# EasyEDA Pro project ProProject_Tautek_ESP32S3_2024-01-15.epro, schematic Schematic1
Create Date: 2023-11-28; Page Name: P1; Project Name: Tautek_ESP32S3; Schematic Name: Schematic1; Update Date: 2024-01-07; Company: EasyEDA.com; Drawed: EasyEDA Pro; Page Size: A4; Part Number: JLCPCB-002; Reviewed: EasyEDA Pro; Version: V0.1
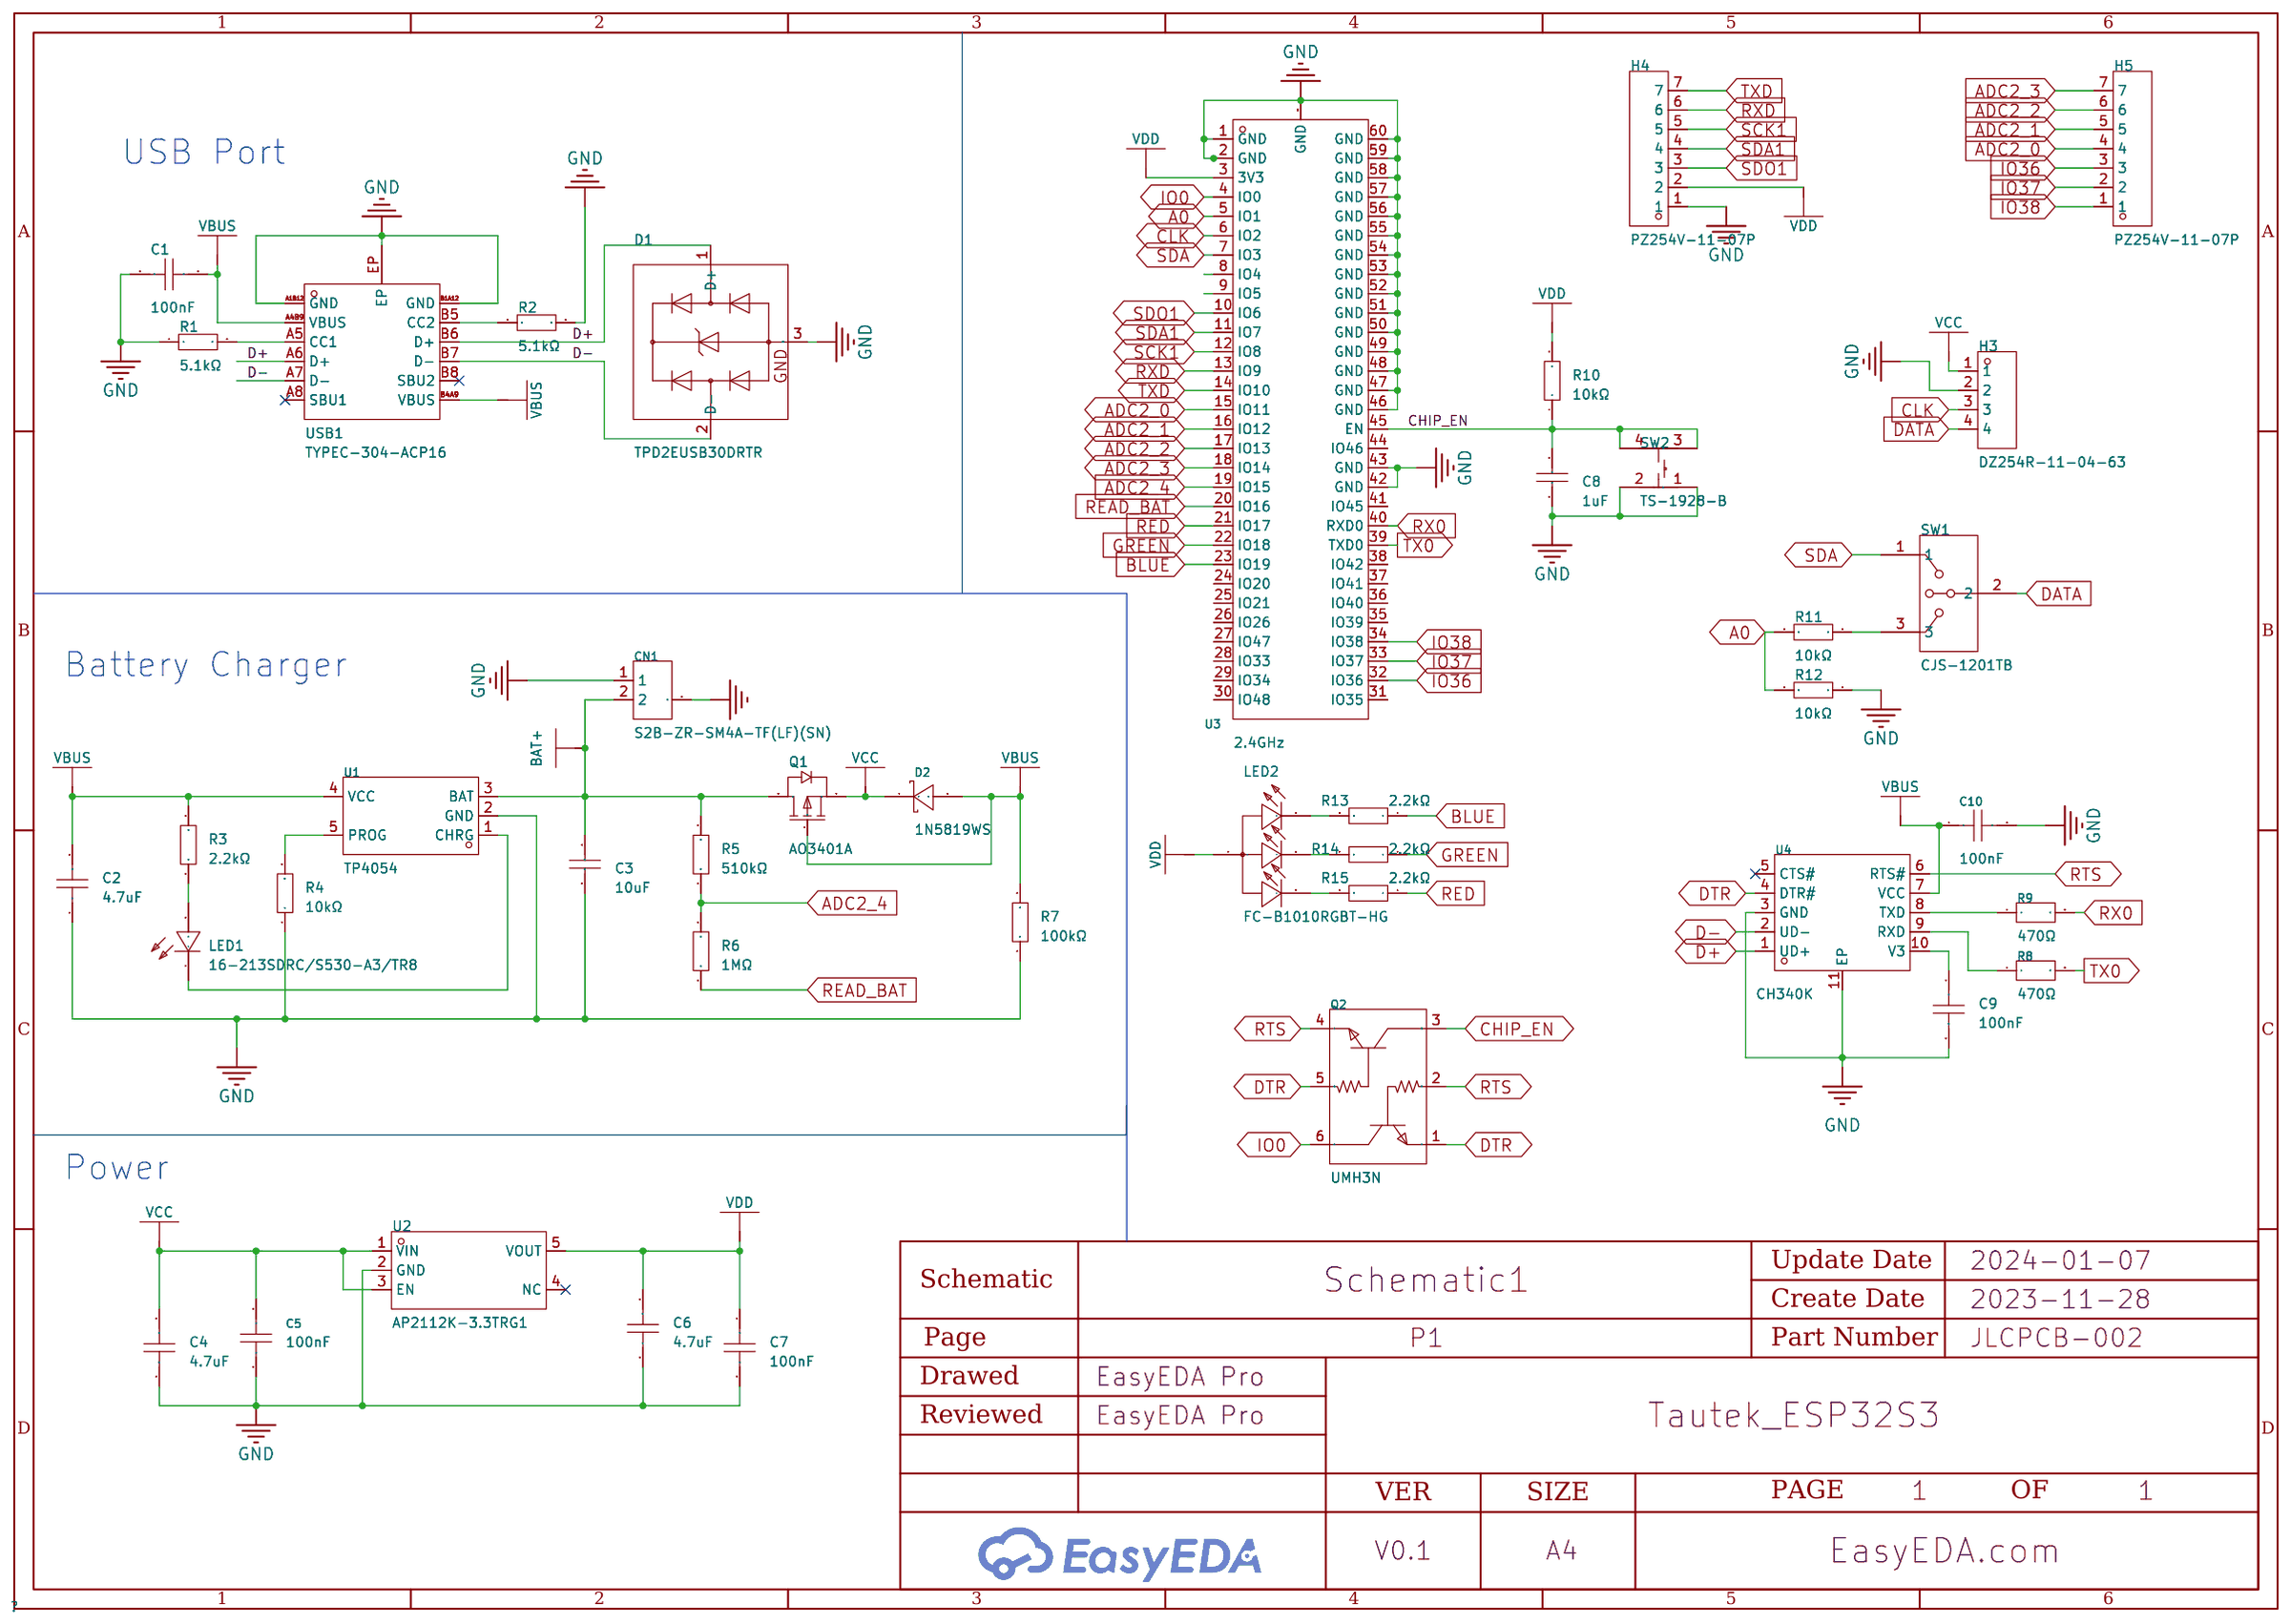
[diagram p1: schematic sheet]

## Parts
C1  100nF  [C0201]
C2  4.7uF  [C0201]
C3  10uF  [C0402]
C4  4.7uF  [C0201]
C5  100nF  [C0201]
C6  4.7uF  [C0201]
C7  100nF  [C0201]
C8  1uF  [C0201]
C9  100nF  [C0201]
C10  100nF  [C0201]
CN1  S2B-ZR-SM4A-TF(LF)(SN)  [CONN-SMD_S2B-ZR-SM4A]
D1  TPD2EUSB30DRTR  [SOT-9X3-3_L1.0-W0.8-P0.35-LS1.0-BR]
D2  1N5819WS  [SOD-323_L1.8-W1.3-LS2.5-RD]
H3  DZ254R-11-04-63  [HDR-TH_4P-P2.54-V-M]
H4  PZ254V-11-07P  [HDR-TH_7P-P2.54-V-M]
H5  PZ254V-11-07P  [HDR-TH_7P-P2.54-V-M]
LED1  16-213SDRC/S530-A3/TR8  [LED0402-RD]
LED2  FC-B1010RGBT-HG  [LED-ARRAY-SMD_4P-L1.0-W1.0-TR-RD]
Q1  AO3401A  [SOT-23_L2.9-W1.3-P1.90-LS2.4-BR]
Q2  UMH3N  [SC-70-6_L2.2-W1.3-P0.65-LS2.1-BR]
R1  5.1kΩ  [R0201]
R2  5.1kΩ  [R0201]
R3  2.2kΩ  [R0201]
R4  10kΩ  [R0201]
R5  510kΩ  [R0201]
R6  1MΩ  [R0201]
R7  100kΩ  [R0201]
R8  470Ω  [R0201]
R9  470Ω  [R0201]
R10  10kΩ  [R0201]
R11  10kΩ  [R0201]
R12  10kΩ  [R0201]
R13  2.2kΩ  [R0201]
R14  2.2kΩ  [R0201]
R15  2.2kΩ  [R0201]
SW1  CJS-1201TB  [SW-SMD_NIDEC_CJS-1201TB]
SW2  TS-1928-B  [KEY-SMD_4P-L2.8-W2.0-P1.20-LS3.0-TL]
U1  TP4054  [TSOT-23-5_L2.9-W1.6-P0.95-LS2.8-BR]
U2  AP2112K-3.3TRG1  [SOT-25-5_L2.9-W1.6-P0.95-LS2.8-BL]
U3  2.4GHz  [BULETM-SMD_ESP32-S3-MINI-1-N8]
U4  CH340K  [ESOP-10_L4.9-W3.9-P1.00-LS6.2-BL-EP]
USB1  TYPEC-304-ACP16  [USB-C-SMD_TYPE-C-16P-1]

## Library data of the parts
C1 C7 C9 = CL03A104KQ3NNNC: Capacitance: Tolerance:±10% Tolerance:±10% Voltage Rated: Temperature Coefficient:; LCSC Part Name: 100nF ±10% 6.3V; Supplier Part: C160831; Manufacturer: SAMSUNG(三星); Supplier Footprint: 0201; JLCPCB Part Class: Extended Part; Datasheet: https://atta.szlcsc.com/upload/public/pdf/source/20171228/C160831_15144412250661213800.pdf; Supplier: LCSC; Tolerance: ±10%
C2 C4 C6 = GRM035R60J475ME15D: Capacitance: Tolerance:±20% Tolerance:±20% Voltage Rated: Temperature Coefficient:; LCSC Part Name: 4.7uF ±20% 6.3V; Supplier Part: C335103; Manufacturer: muRata(村田); Supplier Footprint: 0201; JLCPCB Part Class: Extended Part; Datasheet: https://atta.szlcsc.com/upload/public/pdf/source/20181123/C335103_65BC12EC0C1BBB7D605A3646AEC2CDDD.pdf; Supplier: LCSC; Tolerance: ±20%
C3 = CL05A106MQ5NUNC: Capacitance: Tolerance:±20% Tolerance:±20% Voltage Rated: Temperature Coefficient:; LCSC Part Name: 10uF ±20% 6.3V; Supplier Part: C15525; Manufacturer: SAMSUNG(三星); Supplier Footprint: 0402; JLCPCB Part Class: Basic Part; Datasheet: https://atta.szlcsc.com/upload/public/pdf/source/20220823/2B02EE04F8F211D38A52DCB16EB6BEBA.pdf; Supplier: LCSC; Tolerance: ±20%
C5 C10 = 0201X104K100NT: Capacitance: Tolerance:±10% Tolerance:±10% Voltage Rated: Temperature Coefficient:; LCSC Part Name: 100nF ±10% 10V; Supplier Part: C284966; Manufacturer: FH(风华); Supplier Footprint: 0201; JLCPCB Part Class: Extended Part; Datasheet: https://atta.szlcsc.com/upload/public/pdf/source/20200305/C486355_26A10D38EF8C2A5C37091D0039909270.pdf; Supplier: LCSC; Tolerance: ±10%
C8 = CL03A105MQ3CSNH: Capacitance: Tolerance:±20% Tolerance:±20% Voltage Rated: Temperature Coefficient:; LCSC Part Name: 1uF ±20% 6.3V; Supplier Part: C53067; Manufacturer: SAMSUNG(三星); Supplier Footprint: 0201; JLCPCB Part Class: Extended Part; Datasheet: https://atta.szlcsc.com/upload/public/pdf/source/20160103/1457707736151.pdf; Supplier: LCSC; Tolerance: ±20%
CN1 = S2B-ZR-SM4A-TF(LF)(SN): Reference Series:- Pitch:1.5mm Pins Structure:1x2P Number of Rows:1 Number of PINs Per Row:2 Row Spacing:- Mounting Style:Surface Mount Current Rating (Max):1A Contact Material:Brass Contact Plating:Tin Operating Temperature Range:-25℃~+85℃ Operating Temp; LCSC Part Name: 间距:1.5mm 1x2P 卧贴; Supplier Part: C265329; Manufacturer: JST; Supplier Footprint: SMD,P=1.5mm; JLCPCB Part Class: Extended Part; Datasheet: https://atta.szlcsc.com/upload/public/pdf/source/20181224/C265329_28A547B25CFF51D5CEFCF1A1EBDA8D25.pdf; Supplier: LCSC; Pitch: 1.5mm; Pins Structure: 1x2P; Number of Rows: 1; Number of PINs Per Row: 2; Mounting Style: Surface Mount; Current Rating (Max): 1A; Contact Material: Brass; Contact Plating: Tin; Operating Temperature Range: -25℃~+85℃
D1 = TPD2EUSB30DRTR: Polarity:Unidirectional Reverse Stand-Off Voltage (Vrwm):5.5V Breakdown Voltage (VBR):7V Peak Pulse Current(Ipp)@8/20us:1A Clamping Voltage@Ipp:8V Peak Pulse Power(Ppp)@8/20us:45W Junction Capacitance(Cj)@1MHz:- Operating Temperature:-40℃~+85℃@(Ta) Operat; Supplier Part: C97502; Manufacturer: TI(德州仪器); Supplier Footprint: SOT(9x3); JLCPCB Part Class: Extended Part; Datasheet: https://atta.szlcsc.com/upload/public/pdf/source/20180606/C97502_7D6B9DA0047678414AA5A2CAF7AAB465.pdf; Supplier: LCSC; Polarity: Unidirectional; Reverse Stand-Off Voltage (Vrwm): 5.5V; Breakdown Voltage (VBR): 7V; Peak Pulse Current(Ipp)@8/20us: 1A; Clamping Voltage@Ipp: 8V; Peak Pulse Power(Ppp)@8/20us: 45W; Operating Temperature: -40℃~+85℃@(Ta)
D2 = 1N5819WS_C191023: Reverse Voltage (Vr):40V Average Rectified Current (Io):1A Forward Voltage (Vf@If):600mV@1A; LCSC Part Name: 40V 1A 600mV@1A; Supplier Part: C191023; Manufacturer: Hottech(合科泰); Supplier Footprint: SOD-323; JLCPCB Part Class: Basic Part; Datasheet: https://atta.szlcsc.com/upload/public/pdf/source/20220428/3CB86FD8D28D653594B4E35F9D5AEFD9.pdf; Supplier: LCSC; Reverse Voltage (Vr): 40V; Average Rectified Current (Io): 1A; Forward Voltage (Vf@If): 600mV@1A
H3 = DZ254R-11-04-63: Number of Rows:Plugin Number of Pins:4P Pitch:2.54mm Pin Structure:1x4P Row Spacing:- Mounting Type:Straight Circluar Pins/Square Pins:Square Pins Current Rating (Max):3A Voltage Rating (Max):- Length of Mating Pin:6mm Insulation Height:2.54mm Length of E; LCSC Part Name: 2.54mm 1x4P 直插 方针; Supplier Part: C2935910; Manufacturer: DEALON(德艺隆); Supplier Footprint: 插件,P=2.54mm; JLCPCB Part Class: Extended Part; Datasheet: https://atta.szlcsc.com/upload/public/pdf/source/20211231/575FA3133C71038A037ABECAE7869EE6.pdf; Supplier: LCSC; Number of Rows: Plugin; Number of Pins: 4P; Pitch: 2.54mm; Pin Structure: 1x4P; Mounting Type: Straight; Circluar Pins/Square Pins: Square Pins; Current Rating (Max): 3A; Length of Mating Pin: 6mm; Insulation Height: 2.54mm; Length of End Connection Pin: 3mm
H4 H5 = PZ254V-11-07P: Number of Rows:Plugin Number of Pins:7P Pitch:2.54mm Pin Structure:1x7P Row Spacing:- Mounting Type:Straight Circluar Pins/Square Pins:Square Pins Current Rating (Max):- Voltage Rating (Max):- Length of Mating Pin:6mm Insulation Height:2.5mm Length of End; LCSC Part Name: 2.54mm 1x7P 直插 方针; Supplier Part: C492406; Manufacturer: XFCN(兴飞); Supplier Footprint: 插件,P=2.54mm; JLCPCB Part Class: Extended Part; Datasheet: https://atta.szlcsc.com/upload/public/pdf/source/20200309/C492406_654C533EE691117E22DD9F76C114C2D9.pdf; Supplier: LCSC; Number of Rows: Plugin; Number of Pins: 7P; Pitch: 2.54mm; Pin Structure: 1x7P; Mounting Type: Straight; Circluar Pins/Square Pins: Square Pins; Length of Mating Pin: 6mm; Insulation Height: 2.5mm; Length of End Connection Pin: 3mm; Operating Temperature Range: -40℃~+105℃; Color: Black
LED1 = 16-213SDRC/S530-A3/TR8: Emitted Color:红灯 Lens Color:无色透明 Dominant Wavelength:639nm~639nm Dominant Wavelength:639nm~639nm Peak Wavelength:650nm Forward Current:20mA Forward Voltage (VF):2V Forward Voltage (VF):2V Viewing Angle:120°; LCSC Part Name: 红灯; Supplier Part: C71911; Manufacturer: EVERLIGHT(亿光); Supplier Footprint: 0402; JLCPCB Part Class: Extended Part; Datasheet: https://atta.szlcsc.com/upload/public/pdf/source/20180423/C71911_C51F85E8EEDEC443F292EE02E8E26750.pdf; Supplier: LCSC; Emitted Color: 红灯; Lens Color: 无色透明; Dominant Wavelength: 639nm~639nm; Peak Wavelength: 650nm; Forward Current: 20mA; Forward Voltage (VF): 2V; Viewing Angle: 120°
LED2 = FC-B1010RGBT-HG: Emitted Color:RGB; LCSC Part Name: RGB三色; Supplier Part: C158099; Manufacturer: 国星光电; Supplier Footprint: 0404; JLCPCB Part Class: Extended Part; Datasheet: https://atta.szlcsc.com/upload/public/pdf/source/20200910/C158099_0C805F16310A4C6DB0163E8F613FF382.pdf; Supplier: LCSC; Emitted Color: RGB
Q1 = AO3401A_C347476: Supplier Part: C347476; Manufacturer: UMW(广东友台半导体); Supplier Footprint: SOT-23; JLCPCB Part Class: Extended Part; Datasheet: https://atta.szlcsc.com/upload/public/pdf/source/20190827/C347476_6CCC01FEC3E3D166C83BA0E415FD2056.pdf; Supplier: LCSC
Q2 = UMH3N: Power Dissipation (Pd):150mW Collector-Emitter Breakdown Voltage (Vceo):50V Transistor Type:2个NPN-预偏置 Collector Current (Ic):100mA; LCSC Part Name: 电流:100mA 耐压:50V; Supplier Part: C62892; Manufacturer: CJ(江苏长电/长晶); Supplier Footprint: SC-70-6(SOT-363); JLCPCB Part Class: Extended Part; Datasheet: https://atta.szlcsc.com/upload/public/pdf/source/20151109/1457707575095.pdf; Supplier: LCSC; Power Dissipation (Pd): 150mW; Collector-Emitter Breakdown Voltage (Vceo): 50V; Transistor Type: 2个NPN-预偏置; Collector Current (Ic): 100mA
R1 R2 = RC0201FR-075K1L: Type:Thick Film Resistors Resistance: Tolerance:±1% Tolerance:±1% Power(Watts): Temperature Coefficient:±200ppm/℃ Temperature Coefficient:±200ppm/℃ Overload Voltage (Max): Operating Temperature Range:-55℃~+125℃ Operating Temperature Range:-55℃~+125℃; LCSC Part Name: 厚膜电阻 5.1kΩ ±1% 50mW; Supplier Part: C274341; Manufacturer: YAGEO(国巨); Supplier Footprint: 0201; JLCPCB Part Class: Extended Part; Datasheet: https://atta.szlcsc.com/upload/public/pdf/source/20180821/C275644_0D56F95EFF785E7D9A1FEF436B37DA78.pdf; Supplier: LCSC; Type: Thick Film Resistors; Tolerance: ±1%; Temperature Coefficient: ±200ppm/℃; Operating Temperature Range: -55℃~+125℃
R3 R13-R15 = RC0201FR-072K2L: Type:Thick Film Resistors Resistance: Tolerance:±1% Tolerance:±1% Power(Watts): Temperature Coefficient:±200ppm/℃ Temperature Coefficient:±200ppm/℃ Overload Voltage (Max): Operating Temperature Range:-55℃~+125℃ Operating Temperature Range:-55℃~+125℃; LCSC Part Name: 2.2kΩ ±1% 50mW; Supplier Part: C142018; Manufacturer: YAGEO(国巨); Supplier Footprint: 0201; JLCPCB Part Class: Extended Part; Datasheet: https://atta.szlcsc.com/upload/public/pdf/source/20171113/C142018_15105613515531115845.pdf; Supplier: LCSC; Type: Thick Film Resistors; Tolerance: ±1%; Temperature Coefficient: ±200ppm/℃; Operating Temperature Range: -55℃~+125℃
R4 R10-R12 = RC0201FR-0710KL: Type:Thick Film Resistors Resistance: Tolerance:±1% Tolerance:±1% Power(Watts): Temperature Coefficient:±200ppm/℃ Temperature Coefficient:±200ppm/℃ Overload Voltage (Max): Operating Temperature Range:-55℃~+125℃ Operating Temperature Range:-55℃~+125℃; LCSC Part Name: 10kΩ ±1% 50mW; Supplier Part: C106225; Manufacturer: YAGEO(国巨); Supplier Footprint: 0201; JLCPCB Part Class: Extended Part; Datasheet: https://atta.szlcsc.com/upload/public/pdf/source/20171221/C106225_15138309973201195185.pdf; Supplier: LCSC; Type: Thick Film Resistors; Tolerance: ±1%; Temperature Coefficient: ±200ppm/℃; Operating Temperature Range: -55℃~+125℃
R5 = RC0201FR-07510KL: Type:Thick Film Resistors Resistance: Tolerance:±1% Tolerance:±1% Power(Watts): Temperature Coefficient:±200ppm/℃ Temperature Coefficient:±200ppm/℃ Overload Voltage (Max): Operating Temperature Range:-55℃~+125℃ Operating Temperature Range:-55℃~+125℃; LCSC Part Name: 510kΩ ±1% 50mW; Supplier Part: C295805; Manufacturer: YAGEO(国巨); Supplier Footprint: 0201; JLCPCB Part Class: Extended Part; Datasheet: https://atta.szlcsc.com/upload/public/pdf/source/20180921/C295805_AC1D158A755474E826FD01D881AA929B.pdf; Supplier: LCSC; Type: Thick Film Resistors; Tolerance: ±1%; Temperature Coefficient: ±200ppm/℃; Operating Temperature Range: -55℃~+125℃
R6 = RC0201FR-071ML: Type:Thick Film Resistors Resistance: Tolerance:±1% Tolerance:±1% Power(Watts): Temperature Coefficient:±200ppm/℃ Temperature Coefficient:±200ppm/℃ Overload Voltage (Max): Operating Temperature Range:-55℃~+125℃ Operating Temperature Range:-55℃~+125℃; LCSC Part Name: 1MΩ ±1% 50mW; Supplier Part: C295786; Manufacturer: YAGEO(国巨); Supplier Footprint: 0201; JLCPCB Part Class: Extended Part; Datasheet: https://atta.szlcsc.com/upload/public/pdf/source/20180921/C295786_3F2C1EC02A5F9891A7C118DD4066AFE1.pdf; Supplier: LCSC; Type: Thick Film Resistors; Tolerance: ±1%; Temperature Coefficient: ±200ppm/℃; Operating Temperature Range: -55℃~+125℃
R7 = RC0201FR-07100KL: Resistance: Tolerance:±1% Tolerance:±1% Power(Watts): Temperature Coefficient:±200ppm/℃ Temperature Coefficient:±200ppm/℃ Overload Voltage (Max): Operating Temperature Range:-55℃~+125℃ Operating Temperature Range:-55℃~+125℃; LCSC Part Name: 100kΩ ±1% 50mW; Supplier Part: C106224; Manufacturer: YAGEO(国巨); Supplier Footprint: 0201; JLCPCB Part Class: Extended Part; Datasheet: https://atta.szlcsc.com/upload/public/pdf/source/20171221/C106224_15138309965451195184.pdf; Supplier: LCSC; Tolerance: ±1%; Temperature Coefficient: ±200ppm/℃; Operating Temperature Range: -55℃~+125℃
R8 R9 = 0201WMF4700TEE: Resistance: Tolerance:±1% Tolerance:±1% Power(Watts): Overload Voltage (Max): Temperature Coefficient:±200ppm/℃ Temperature Coefficient:±200ppm/℃ Type:Thick Film Resistors Operating Temperature Range:-55℃~+155℃ Operating Temperature Range:-55℃~+155℃; LCSC Part Name: 470Ω ±1% 50mW 厚膜电阻; Supplier Part: C473464; Manufacturer: UNI-ROYAL(厚声); Supplier Footprint: 0201; JLCPCB Part Class: Extended Part; Datasheet: https://atta.szlcsc.com/upload/public/pdf/source/20200306/C422600_1E6D84923E4A46A82E41ADD87F860B5C.pdf; Supplier: LCSC; Tolerance: ±1%; Temperature Coefficient: ±200ppm/℃; Type: Thick Film Resistors; Operating Temperature Range: -55℃~+155℃
SW1 = CJS-1201TB: Current Rating (DC):100mA Voltage Rating (DC):50V Circuit:SPDT Mounting Style:Brick nogging Mechanical Life:- Actuator Color:White Actuator Style:Embedded Pin Style:Gull Wing Operating Temperature:-40℃~+85℃ Operating Temperature:-40℃~+85℃ Switch Length:5.; LCSC Part Name: 立贴两档 滑动开关; Supplier Part: C2921634; Manufacturer: NIDEC(尼得科); Supplier Footprint: SMD; JLCPCB Part Class: Extended Part; Datasheet: https://atta.szlcsc.com/upload/public/pdf/source/20220330/6745523F18B9E1D27C13F1DF80783005.pdf; Supplier: LCSC; Current Rating (DC): 100mA; Voltage Rating (DC): 50V; Circuit: SPDT; Mounting Style: Brick nogging; Actuator Color: White; Actuator Style: Embedded; Pin Style: Gull Wing; Operating Temperature: -40℃~+85℃; Switch Length: 5.4mm; Switch Width: 2.5mm; Switch Height: 2.5mm
SW2 = TS-1928-B: Contact Current:50mA Voltage Rating (DC):12V Insulation Resistance:- Circuit:SPST Mounting Style:Brick nogging Actuator Style:Round Button Actuator/Cap Color:Black With Lamp:No Operating Force:160gf Mechanical Life:300000次 Operating Temperature:-30℃~+85℃; LCSC Part Name: 立贴 1.95*2.8*0.6mm 轻触开关; Supplier Part: C1121891; Manufacturer: XKB Connectivity(中国星坤); Supplier Footprint: SMD; JLCPCB Part Class: Extended Part; Datasheet: https://atta.szlcsc.com/upload/public/pdf/source/20211011/D4E0D57631292A8298BD84F341C06C74.pdf; Supplier: LCSC; Contact Current: 50mA; Voltage Rating (DC): 12V; Circuit: SPST; Mounting Style: Brick nogging; Actuator Style: Round Button; Actuator/Cap Color: Black; With Lamp: No; Operating Force: 160gf; Mechanical Life: 300000次; Operating Temperature: -30℃~+85℃; Switch Length: 1.95mm; Switch Width: 2.8mm; Switch Height: 0.6mm; Strike Gundam: NO
U1 = TP4054_C668215: Type of Battery:锂离子/Polymer Number of Cells:1 Number of Cells:1 Maximum Charge Current:500mA Supply Voltage:6.5V Supply Voltage:6.5V Operating Temperature:-40℃~+85℃ Operating Temperature:-40℃~+85℃; Supplier Part: C668215; Manufacturer: UMW(友台半导体); Supplier Footprint: SOT-23-5; JLCPCB Part Class: Extended Part; Datasheet: https://atta.szlcsc.com/upload/public/pdf/source/20211011/DD9DB39E30D67DDF115F79B4376A27FF.pdf; Supplier: LCSC; Type of Battery: 锂离子/Polymer; Number of Cells: 1; Maximum Charge Current: 500mA; Supply Voltage: 6.5V; Operating Temperature: -40℃~+85℃
U2 = AP2112K-3.3TRG1: Output Type: Output Polarity:Positive Number of Outputs:1 Maximum Input Voltage:6V Output Voltage:3.3V~3.3V Output Voltage:3.3V~3.3V Dropout Voltage:400mV@(600mA) Output Current:600mA Power Supply Rejection Ratio (PSRR):65dB@(100Hz,1kHz); Supplier Part: C51118; Manufacturer: DIODES(美台); Supplier Footprint: SOT-25-5; JLCPCB Part Class: Extended Part; Datasheet: https://atta.szlcsc.com/upload/public/pdf/source/20171221/C51118_15138312998391195590.pdf; Supplier: LCSC; Output Polarity: Positive; Number of Outputs: 1; Maximum Input Voltage: 6V; Output Voltage: 3.3V~3.3V; Dropout Voltage: 400mV@(600mA); Output Current: 600mA; Power Supply Rejection Ratio (PSRR): 65dB@(100Hz,1kHz)
U3 = ESP32-S3-MINI-1-N8: Frequency:2.4GHz Output Power:20.5dBm Output Power:20.5dBm Core Processor:ESP32-S3R8 Support Interface:I2C；GPIO；SPI；PWM；ADC；UART；USB；I2S; Supplier Part: C2913206; Manufacturer: ESPRESSIF(乐鑫); Supplier Footprint: SMD-41P; JLCPCB Part Class: Extended Part; Datasheet: https://atta.szlcsc.com/upload/public/pdf/source/20220425/7F117D7A09F85946280540FD9EFDF9F3.pdf; Supplier: LCSC; Output Power: 20.5dBm; Core Processor: ESP32-S3R8; Support Interface: I2C；GPIO；SPI；PWM；ADC；UART；USB；I2S
U4 = CH340K: Applications Function: Protocol:; LCSC Part Name: CH340K USB转串口芯片 CH340; Supplier Part: C968586; Manufacturer: WCH(南京沁恒); Supplier Footprint: ESOP-10-EP-150mil; JLCPCB Part Class: Extended Part; Datasheet: https://atta.szlcsc.com/upload/public/pdf/source/20200819/C84681_ADBED554CE321879DBD6B1D06488689C.pdf; Supplier: LCSC
USB1 = TYPEC-304-ACP16: Connector Type:Type-C Gender:Female Number of Contacts:16 Number of Ports:1 Mounting Style:Surface Mount Current Rating - Power (Max):3A Operating Temperature Range:-40℃~+85℃ Operating Temperature Range:-40℃~+85℃; LCSC Part Name: Type-C 母座 卧贴; Supplier Part: C2982555; Manufacturer: XUNPU(讯普); Supplier Footprint: SMD; JLCPCB Part Class: Extended Part; Supplier: LCSC; Connector Type: Type-C; Gender: Female; Number of Contacts: 16; Number of Ports: 1; Mounting Style: Surface Mount; Current Rating - Power (Max): 3A; Operating Temperature Range: -40℃~+85℃

## Nets
GND: C1.1 C2.1 C3.1 C4.1 C5.1 C6.1 C7.2 C8.1 C9.2 C10.2 CN1.0 CN1.1 D1.3(GND) H3.2 H4.1 R1.1 R2.2 R4.1 R7.1 R12.1 SW2.1 SW2.2 U1.2(GND) U2.2(GND) U3.1(GND) U3.2(GND) U3.42(GND) U3.43(GND) U3.46(GND) U3.47(GND) U3.48(GND) U3.49(GND) U3.50(GND) U3.51(GND) U3.52(GND) U3.53(GND) U3.54(GND) U3.55(GND) U3.56(GND) U3.57(GND) U3.58(GND) U3.59(GND) U3.60(GND) U3.GND U4.3(GND) U4.11(EP) USB1.A1B12(GND) USB1.B1A12(GND) USB1.EP
VBUS: C1.2 C2.2 C10.1 D2.2(A) Q1.1(G) R3.2 R7.2 U1.4(VCC) U4.7(VCC) USB1.A4B9(VBUS) USB1.B4A9(VBUS)
VCC: C4.2 C5.2 D2.1(K) H3.1 Q1.2(S) U2.1(VIN) U2.3(EN)
VDD: C6.2 C7.1 H4.2 LED2.1(+) R10.2 U2.5(VOUT) U3.3(3V3)
A0: R11.2 R12.2 U3.5(IO1)
ADC2_0: H5.4 U3.15(IO11)
ADC2_1: H5.5 U3.16(IO12)
ADC2_2: H5.6 U3.17(IO13)
ADC2_3: H5.7 U3.18(IO14)
ADC2_4: R5.1 R6.1 U3.19(IO15)
BAT+: C3.2 CN1.2 Q1.3(D) R5.2 U1.3(BAT)
BLUE: R13.1 U3.23(IO19)
CHIP_EN: C8.2 Q2.3(C) R10.1 SW2.3 SW2.4 U3.45(EN)
CLK: H3.3 U3.6(IO2)
D+: D1.1(D+) U4.1(UD+) USB1.A6(D+) USB1.B6(D+)
D-: D1.2(D-) U4.2(UD-) USB1.A7(D-) USB1.B7(D-)
DATA: H3.4 SW1.2
DTR: Q2.1(E) Q2.5(B) U4.4(DTR#)
GREEN: R14.1 U3.22(IO18)
IO0: Q2.6(C) U3.4(IO0)
IO36: H5.3 U3.32(IO36)
IO37: H5.2 U3.33(IO37)
IO38: H5.1 U3.34(IO38)
READ_BAT: R6.2 U3.20(IO16)
RED: R15.1 U3.21(IO17)
RTS: Q2.2(B) Q2.4(E) U4.6(RTS#)
RX0: R9.2 U3.40(RXD0)
RXD: H4.6 U3.13(IO9)
SCK1: H4.5 U3.12(IO8)
SDA: SW1.1 U3.7(IO3)
SDA1: H4.4 U3.11(IO7)
SDO1: H4.3 U3.10(IO6)
TX0: R8.2 U3.39(TXD0)
TXD: H4.7 U3.14(IO10)
$1N1876: R1.2 USB1.A5(CC1)
$1N1877: R2.1 USB1.B5(CC2)
$1N2402: R4.2 U1.5(PROG)
$1N2411: LED1.2(+) R3.1
$1N2412: LED1.1(-) U1.1(CHRG)
$1N4112: R9.1 U4.8(TXD)
$1N4115: R8.1 U4.9(RXD)
$1N4150: C9.1 U4.10(V3)
$1N6523: R11.1 SW1.3
$1N9339: LED2.4(-) R13.2
$1N9340: LED2.3(-) R14.2
$1N9341: LED2.2(-) R15.2

Not connected (* = marked no-connect by the designer): U2 4(NC)*; U3 8(IO4) 9(IO5) 24(IO20) 25(IO21) 26(IO26) 27(IO47) 28(IO33) 29(IO34) 30(IO48) 31(IO35) 35(IO39) 36(IO40) 37(IO41) 38(IO42) 41(IO45) 44(IO46); U4 5(CTS#)*; USB1 A8(SBU1)* B8(SBU2)*

## Notes on the sheet
- USB Port
- Battery Charger
- Power
